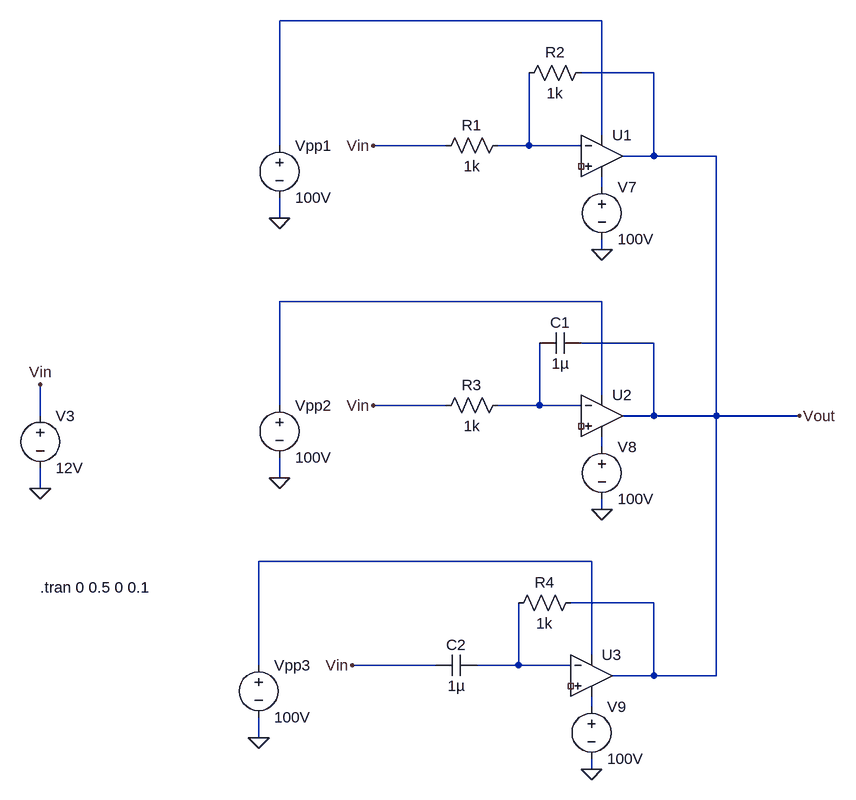
[diagram p0: schematic PID_opamp.asc]
PID_opamp.asc, the LTspice schematic file:
Version 4
SHEET 1 880 884
WIRE 224 -288 -272 -288
WIRE 304 -208 192 -208
WIRE 224 -112 224 -288
WIRE -272 -96 -272 -288
WIRE -16 -96 -128 -96
WIRE 112 -96 112 -208
WIRE 112 -96 64 -96
WIRE 192 -96 112 -96
WIRE 304 -80 304 -208
WIRE 304 -80 256 -80
WIRE 400 -80 304 -80
WIRE 224 -32 224 -48
WIRE -272 16 -272 -16
WIRE 224 64 224 48
WIRE 224 144 -272 144
WIRE 304 208 192 208
WIRE 224 288 224 144
WIRE -272 304 -272 144
WIRE -16 304 -128 304
WIRE 128 304 128 208
WIRE 128 304 64 304
WIRE 192 304 128 304
WIRE -640 320 -640 272
WIRE 304 320 304 208
WIRE 304 320 256 320
WIRE 400 320 400 -80
WIRE 400 320 304 320
WIRE 528 320 400 320
WIRE 224 368 224 352
WIRE -272 416 -272 384
WIRE -640 432 -640 400
WIRE 224 464 224 448
WIRE 208 544 -304 544
WIRE 304 608 176 608
WIRE 208 688 208 544
WIRE -304 704 -304 544
WIRE -32 704 -160 704
WIRE 96 704 96 608
WIRE 96 704 32 704
WIRE 176 704 96 704
WIRE 304 720 304 608
WIRE 304 720 240 720
WIRE 400 720 400 320
WIRE 400 720 304 720
WIRE 208 768 208 752
WIRE -304 816 -304 784
WIRE 208 864 208 848
FLAG 208 864 0
FLAG -304 816 0
FLAG 224 464 0
FLAG -272 416 0
FLAG 224 64 0
FLAG -272 16 0
FLAG -128 -96 Vin
FLAG -128 304 Vin
FLAG -640 432 0
FLAG -640 272 Vin
FLAG -160 704 Vin
FLAG 528 320 Vout
SYMBOL Opamps\\UniversalOpamp2 224 -80 R0
SYMATTR InstName U1
SYMBOL Opamps\\UniversalOpamp2 224 320 R0
SYMATTR InstName U2
SYMBOL Opamps\\UniversalOpamp2 208 720 R0
SYMATTR InstName U3
SYMBOL res 80 -112 R90
WINDOW 0 0 56 VBottom 2
WINDOW 3 32 56 VTop 2
SYMATTR InstName R1
SYMATTR Value 1k
SYMBOL res 208 -224 R90
WINDOW 0 0 56 VBottom 2
WINDOW 3 32 56 VTop 2
SYMATTR InstName R2
SYMATTR Value 1k
SYMBOL res 80 288 R90
WINDOW 0 0 56 VBottom 2
WINDOW 3 32 56 VTop 2
SYMATTR InstName R3
SYMATTR Value 1k
SYMBOL res 192 592 R90
WINDOW 0 0 56 VBottom 2
WINDOW 3 32 56 VTop 2
SYMATTR InstName R4
SYMATTR Value 1k
SYMBOL cap 192 192 R90
WINDOW 0 0 32 VBottom 2
WINDOW 3 32 32 VTop 2
SYMATTR InstName C1
SYMATTR Value 1µ
SYMBOL cap 32 688 R90
WINDOW 0 0 32 VBottom 2
WINDOW 3 32 32 VTop 2
SYMATTR InstName C2
SYMATTR Value 1µ
SYMBOL voltage -640 304 R0
WINDOW 123 0 0 Left 0
WINDOW 39 0 0 Left 0
SYMATTR InstName V3
SYMATTR Value 12V
SYMBOL voltage -272 -112 R0
WINDOW 123 0 0 Left 0
WINDOW 39 0 0 Left 0
SYMATTR InstName Vpp1
SYMATTR Value 100V
SYMBOL voltage -272 288 R0
WINDOW 123 0 0 Left 0
WINDOW 39 0 0 Left 0
SYMATTR InstName Vpp2
SYMATTR Value 100V
SYMBOL voltage -304 688 R0
WINDOW 123 0 0 Left 0
WINDOW 39 0 0 Left 0
SYMATTR InstName Vpp3
SYMATTR Value 100V
SYMBOL voltage 224 -48 R0
WINDOW 123 0 0 Left 0
WINDOW 39 0 0 Left 0
SYMATTR InstName V7
SYMATTR Value 100V
SYMBOL voltage 224 352 R0
WINDOW 123 0 0 Left 0
WINDOW 39 0 0 Left 0
SYMATTR InstName V8
SYMATTR Value 100V
SYMBOL voltage 208 752 R0
WINDOW 123 0 0 Left 0
WINDOW 39 0 0 Left 0
SYMATTR InstName V9
SYMATTR Value 100V
TEXT -640 584 Left 2 !.tran 0 0.5 0 0.1

The netlist it stands for:
* PID_opamp.asc
XU1 NC_01 N002 N001 N003 Vout level.2 Avol=1Meg GBW=10Meg Slew=10Meg ilimit=25m rail=0 Vos=0 phimargin=45 en=0 enk=0 in=0 ink=0 Rin=500Meg  ; pins IN+ IN- V+ V- OUT
XU2 NC_02 N005 N004 N006 Vout level.2 Avol=1Meg GBW=10Meg Slew=10Meg ilimit=25m rail=0 Vos=0 phimargin=45 en=0 enk=0 in=0 ink=0 Rin=500Meg  ; pins IN+ IN- V+ V- OUT
XU3 NC_03 N008 N007 N009 Vout level.2 Avol=1Meg GBW=10Meg Slew=10Meg ilimit=25m rail=0 Vos=0 phimargin=45 en=0 enk=0 in=0 ink=0 Rin=500Meg  ; pins IN+ IN- V+ V- OUT
R1 N002 Vin 1k
R2 Vout N002 1k
R3 N005 Vin 1k
R4 Vout N008 1k
C1 Vout N005 1µ
C2 N008 Vin 1µ
V3 Vin 0 12V
Vpp1 N001 0 100V
Vpp2 N004 0 100V
Vpp3 N007 0 100V
V7 N003 0 100V
V8 N006 0 100V
V9 N009 0 100V
.tran 0 0.5 0 0.1
.lib UniversalOpamps2.sub
.backanno
.end